# EAGLE schematic 555_boost_converter_fixed_gain (EAGLE 6.5.0)
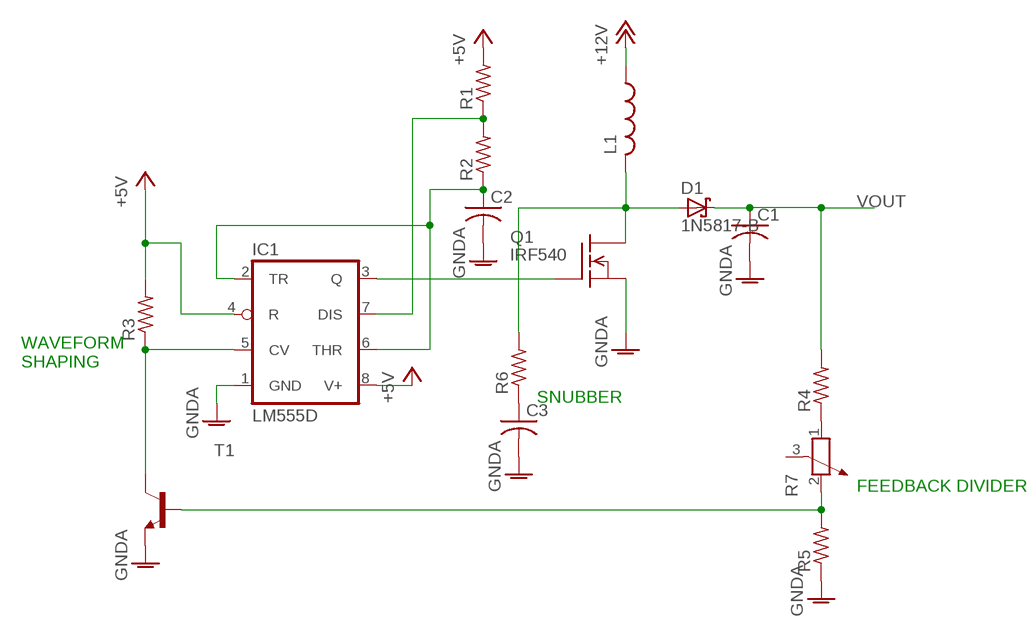
[diagram p0: schematic, sheet 1]

## Parts
C1  C-USC0805  [C0805]
C2  C-USC0805  [C0805]
C3  C-USC0805  [C0805]
D1  1N5817-B  [DO41-7.6]
IC1  LM555D  [SO08]
L1  L-USTJ3-U2  [TJ3-U2]
Q1  IRF540  [TO220]
R1  R-US_R0805  [R0805]
R2  R-US_R0805  [R0805]
R3  R-US_R0805  [R0805]
R4  R-US_R0805  [R0805]
R5  R-US_R0805  [R0805]
R6  R-US_R0805  [R0805]
R7  POTENTIOMETER_PT_SPIN  [PT-SPIN]
T1  2N2222-NPN-TO92-EBC  [TO92-EBC]

## Nets
+5V: IC1.4(R) IC1.8(V+) R1.2 R3.2
+12V: L1.1
GNDA: C1.2 C2.2 C3.2 IC1.1(GND) Q1.3(S) R5.1 T1.E
N$1: D1.A L1.2 Q1.2(D) R6.2
N$2: IC1.3(Q) Q1.1(G)
N$3: IC1.7(DIS) R1.1 R2.2
N$4: C2.1 IC1.2(TR) IC1.6(THR) R2.1
N$5: C3.1 R6.1
N$6: IC1.5(CV) R3.1 T1.C
N$7: R4.1 R7.1
N$8: R5.2 R7.2 T1.B
VOUT: C1.1 D1.C R4.2
Unconnected: R7.3

## Notes on the sheet
- WAVEFORM 
  SHAPING
- SNUBBER
- FEEDBACK DIVIDER

## Library data of the parts
C1-C3 = rcl:C-US: CAPACITOR, American symbol
D1 = diode:1N581*: 1.0A SCHOTTKY BARRIER RECTIFIER Source: http://www.diodes.com/datasheets/ds23001.pdf
IC1 = linear:*555: TIMER
L1 = rcl:L-US: INDUCTOR, American symbol
Q1 = transistor-fet:IRF540: N-Channel Enhancement MOSFET (HEXFET); 100V; 28A; 0,077Ohm
R1-R6 = rcl:R-US_: RESISTOR, American symbol
R7 = rcl:POTENTIOMETER_: Potentiometer
T1 = transistor-neu-to92:*-NPN-: NPN Transistror